# Altium schematic sheet CATS-EUROC-Pyro.SchDoc: CATS EuRoC Edition
size A4; DocumentNumber: Overview; Revision: V1.0; SheetNumber: 10; SheetTotal: 16; Author: Luca Jost; Subtitle: Pyro Channel
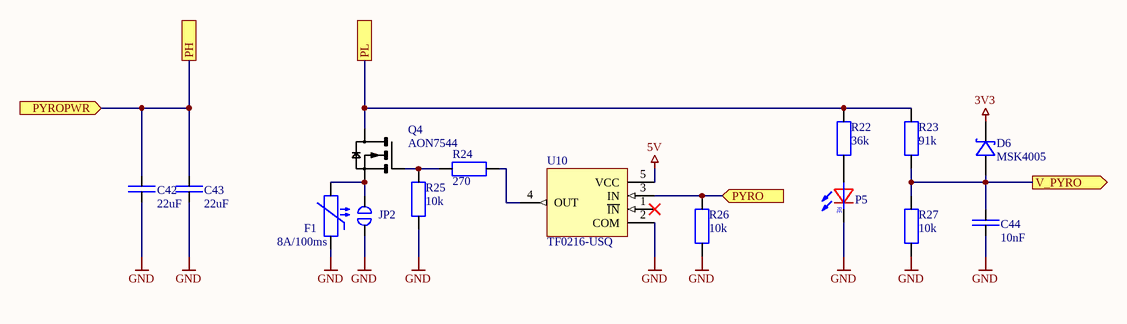
[diagram p0: CATS-EUROC-Pyro.SchDoc]

## Parts
C42  22uF  [SMD Keramikkondensator 0805]
C43  22uF  [SMD Keramikkondensator 0805]
C44  10nF  [SMD Keramikkondensator 0402]
D6  MSK4005  [SMD Diode SOD-523]
F1  8A/100ms  [SMD PPTC-Fuse 1206]
JP2  Jumper  [SMD Solder Jumper 1x2mm]  (value not drawn)  (no BOM)
P5  LED  [SMD LED 0603]  (value not drawn)
Q4  AON7544  [SMD MOSFET DFN 3x3 EP]
R22  36k  [SMD Widerstand 0402]
R23  91k  [SMD Widerstand 0402]
R24  270  [SMD Widerstand 0402]
R25  10k  [SMD Widerstand 0402]
R26  10k  [SMD Widerstand 0402]
R27  10k  [SMD Widerstand 0402]
U10  TF0216-USQ  [SMD IC SOT-23-5]

## Ports
PH, PL, PYRO (in), PYROPWR (in), V_PYRO (out)

## Nets
3V3: D6.K
5V: U10.5(VCC)
GND: C42.1 C43.1 C44.1 F1.2 JP2.2 P5.K R25.1 R26.1 R27.1 U10.2(COM)
PH: C42.2 C43.2 ; port PH, port PYROPWR
PL: Q4.D R22.2 R23.2 ; port PL
PYRO: R26.2 U10.3(IN) ; port PYRO
V_PYRO: C44.2 D6.A R23.1 R27.2 ; port V_PYRO
NetF1_1: F1.1 JP2.1 Q4.S
NetP5_A: P5.A R22.1
NetQ4_G: Q4.G R24.1 R25.2
NetR24_2: R24.2 U10.4(OUT)

Not connected (* = marked no-connect by the designer): U10 1(~{IN})*

## Notes on the sheet
- Title
- Author:
- Subtitle
- Date:
- Rev:
- File:
- Sheet
- of
- (in symbol LED) RE

## Library data of the parts
C42 C43 = E6 - 22uF: SMD Ceramic Capacitor E6; Unit Price: 0.01; Number: -; Supplier: -; JLC: C45783
C44 = E6 - 10nF: SMD Ceramic Capacitor E6; Unit Price: 0.01; Number: -; Supplier: -; JLC: C15195
D6 = MSK4005: SOD-523 Schottky Barrier Diode; ComponentLink1Description: Datasheet; ComponentLink1URL: https://datasheet.lcsc.com/lcsc/1912111437_Shikues-MSK4005_C345957.pdf; JLC: C345957
F1 = nSMD100-16V: 16V 1A 100A 1.8A 1206 Resettable; JLC: C70082; ComponentLink1Description: Datasheet; ComponentLink1URL: https://datasheet.lcsc.com/lcsc/1810261625_TECHFUSE-nSMD100-16V_C70082.pdf
JP2 = Jumper-1: Single Position Jumper
P5 = LED: Color LED
Q4 = AON7544: N-Channel 30V 30A Surface Mount 8-DFN (3x3); ComponentLink1Description: Datasheet; ComponentLink1URL: https://datasheet.lcsc.com/lcsc/1912111437_Alpha---Omega-Semicon-AON7544_C315567.pdf; JLC: C315567
R22 = E24 - 36k: SMD Chip Resistor E24; Unit Price: 0.01; Number: -; Supplier: -; JLC: C43676
R23 = E24 - 91k: SMD Chip Resistor E24; Unit Price: 0.01; Number: -; Supplier: -; JLC: C4147
R24 = E24 - 270: SMD Chip Resistor E24; Unit Price: 0.01; Number: -; Supplier: -; JLC: C25099
R25-R27 = E24 - 10k: SMD Chip Resistor E24; Unit Price: 0.01; Number: -; Supplier: -; JLC: C25744
U10 = TF0216-USQ: SOT-23-5L Gate Drive IC; JLC: C2683769; ComponentLink1Description: Datasheet; ComponentLink1URL: https://datasheet.lcsc.com/lcsc/2106070334_TFSS-TF0216-USQ_C2683769.pdf